# Altium schematic sheet Snip_MCU.SchDoc
size C
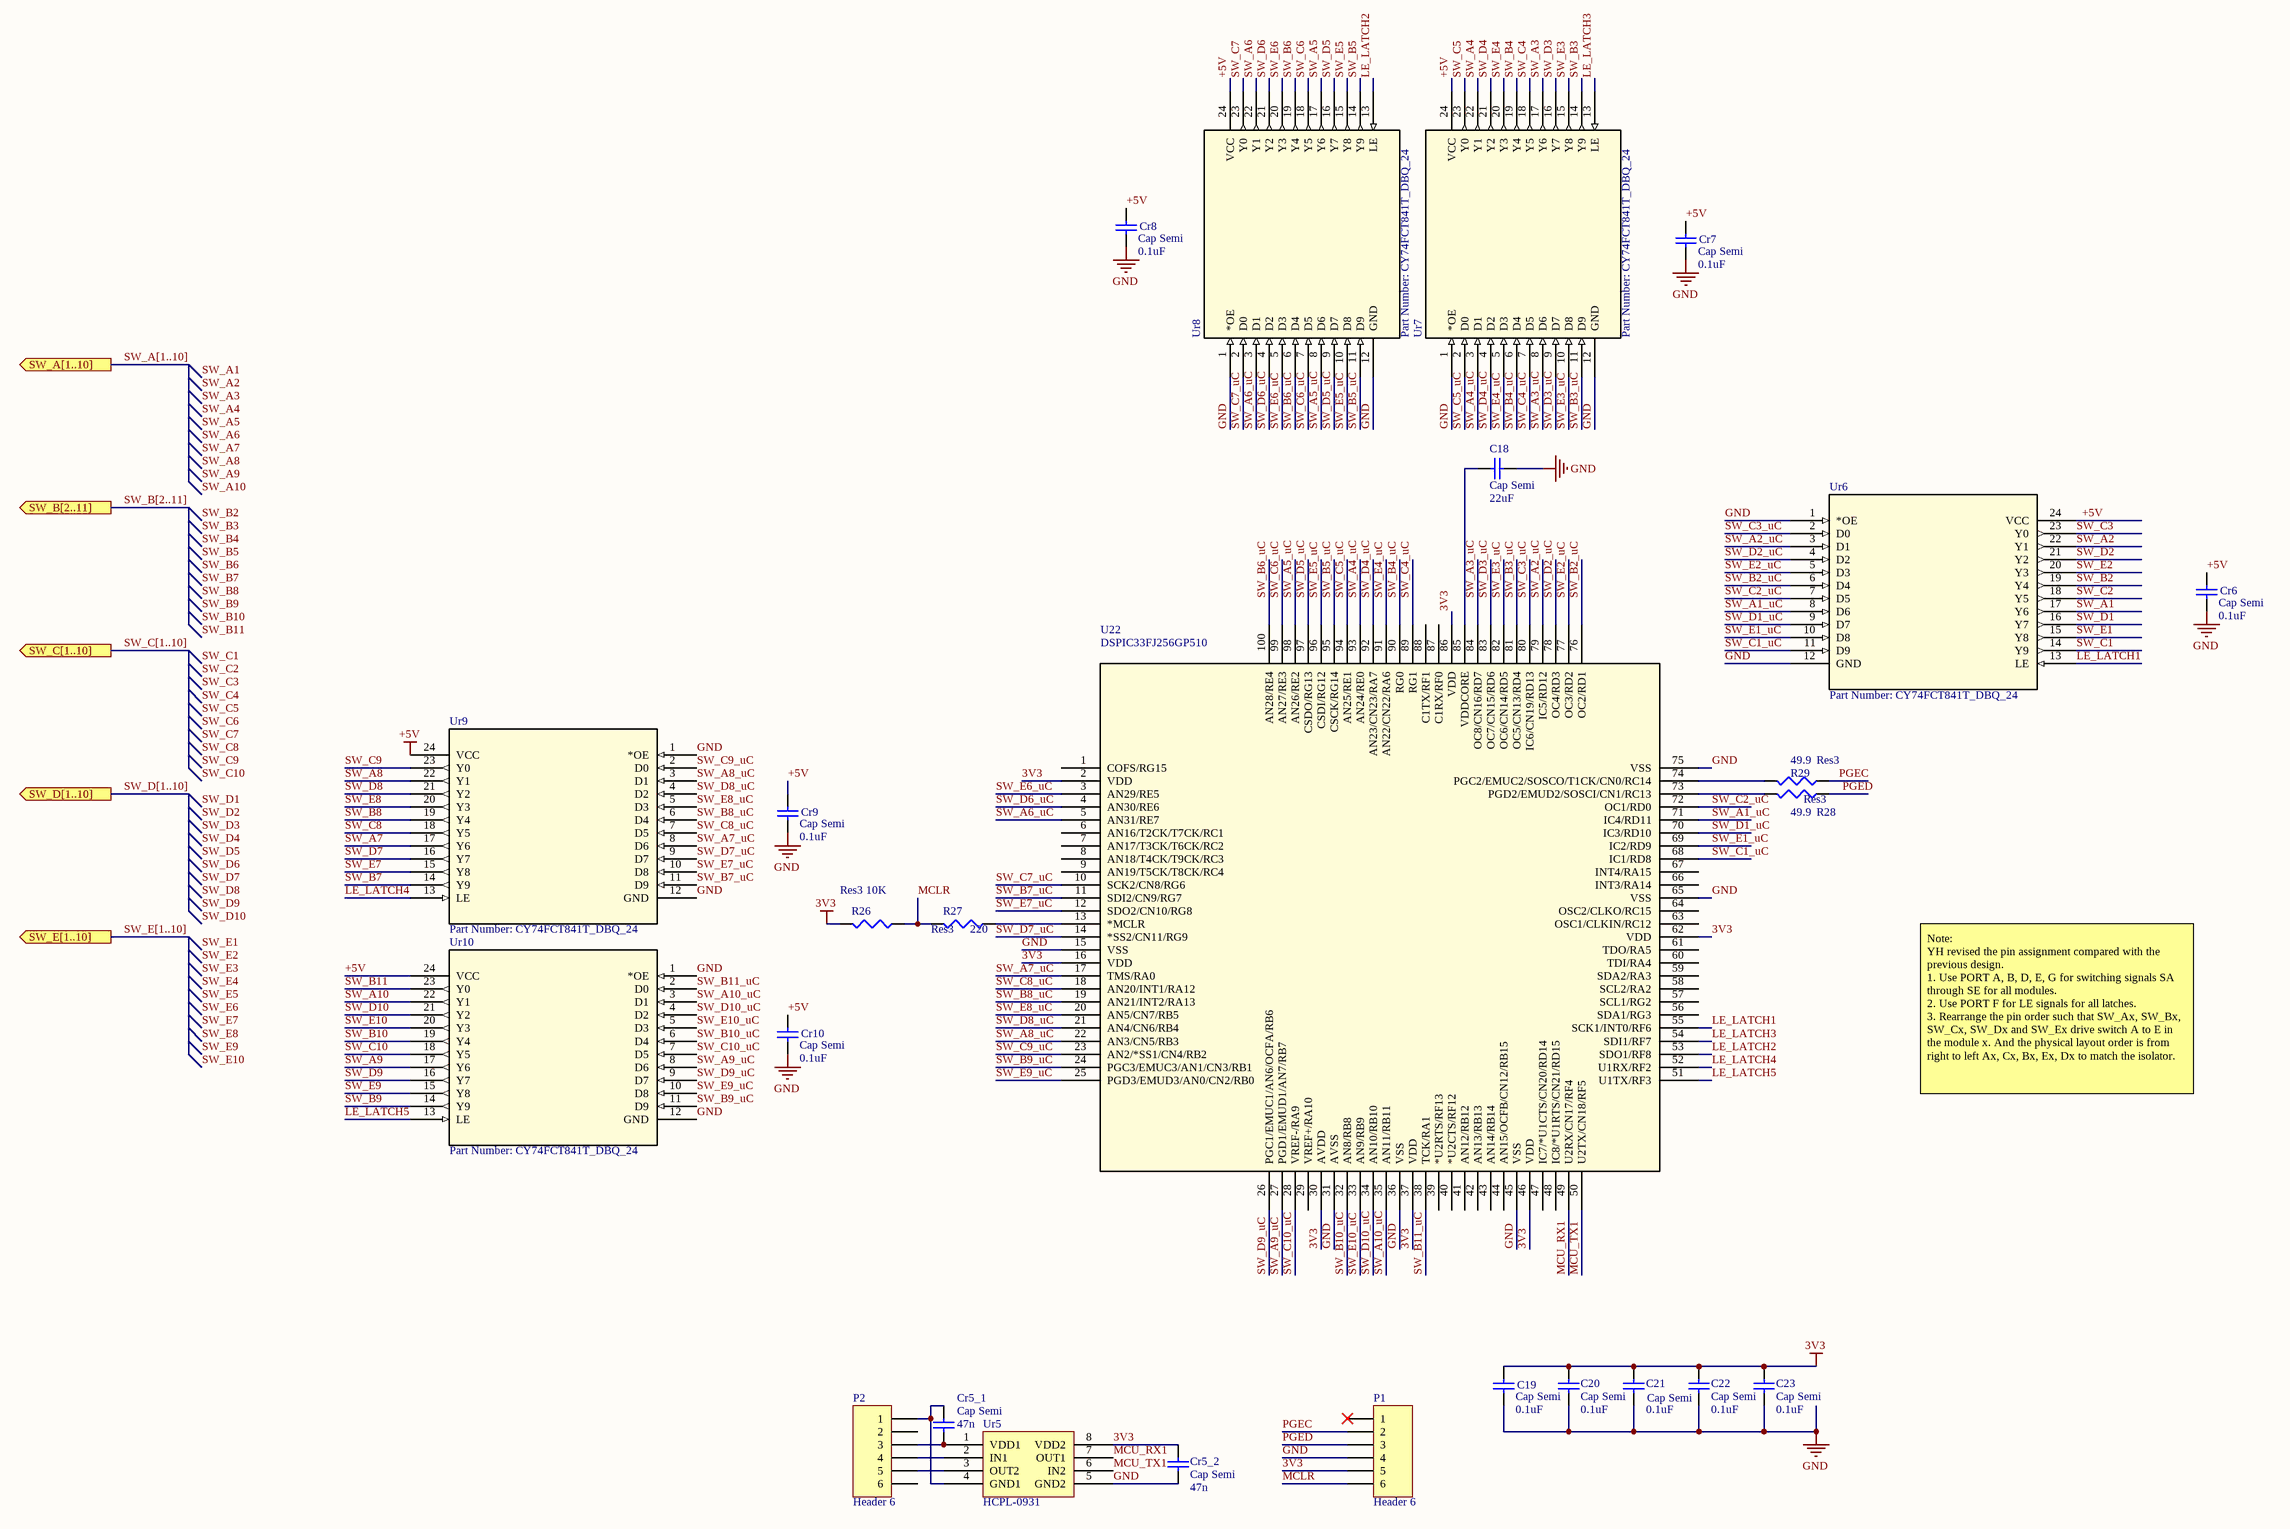
[diagram p0: Snip_MCU.SchDoc]

## Parts
C18  Cap Semi  value 22uF  [0805]
C19  Cap Semi  value 0.1uF  [1608[0603]]
C20  Cap Semi  value 0.1uF  [1608[0603]]
C21  Cap Semi  value 0.1uF  [1608[0603]]
C22  Cap Semi  value 0.1uF  [1608[0603]]
C23  Cap Semi  value 0.1uF  [1608[0603]]
Cr5_1  Cap Semi  value 47n  [C1206]
Cr5_2  Cap Semi  value 47n  [C1206]
Cr6  Cap Semi  value 0.1uF  [1608[0603]]
Cr7  Cap Semi  value 0.1uF  [1608[0603]]
Cr8  Cap Semi  value 0.1uF  [1608[0603]]
Cr9  Cap Semi  value 0.1uF  [1608[0603]]
Cr10  Cap Semi  value 0.1uF  [1608[0603]]
P1  Header 6  [HDR1X6]
P2  Header 6  [HDR1X6]
R26  Res3  value 10K  [J1-0603]
R27  Res3  value 220  [J1-0603]
R28  Res3  value 49.9  [J1-0603]
R29  Res3  value 49.9  [J1-0603]
U22  DSPIC33FJ256GP510  [TQFP100_12x12MC-]
Ur5  HCPL-0931  [SOIC-8]
Ur6  Part Number: CY74FCT841T_DBQ_24  [DBQ24]
Ur7  Part Number: CY74FCT841T_DBQ_24  [DBQ24]
Ur8  Part Number: CY74FCT841T_DBQ_24  [DBQ24]
Ur9  Part Number: CY74FCT841T_DBQ_24  [DBQ24]
Ur10  Part Number: CY74FCT841T_DBQ_24  [DBQ24]

## Ports
SW_A[1..10] (out), SW_B[2..11] (out), SW_C[1..10] (out), SW_D[1..10] (out), SW_E[1..10] (out)

## Nets
3V3: C19.2 C20.2 C21.2 C22.2 C23.2 Cr5_2.2 P1.5 R26.2 U22.2(VDD) U22.16(VDD) U22.30(AVDD) U22.37(VDD) U22.46(VDD) U22.62(VDD) U22.86(VDD) Ur5.8(VDD2)
+5V: Cr6.2 Cr7.2 Cr8.2 Cr9.2 Cr10.2 Ur6.24(VCC) Ur7.24(VCC) Ur8.24(VCC) Ur9.24(VCC) Ur10.24(VCC)
GND: C18.2 C19.1 C20.1 C21.1 C22.1 C23.1 Cr5_2.1 Cr6.1 Cr7.1 Cr8.1 Cr9.1 Cr10.1 P1.4 U22.15(VSS) U22.31(AVSS) U22.36(VSS) U22.45(VSS) U22.65(VSS) U22.75(VSS) Ur5.5(GND2) Ur6.1(*OE) Ur6.12(GND) Ur7.1(*OE) Ur7.12(GND) Ur8.1(*OE) Ur8.12(GND) Ur9.1(*OE) Ur9.12(GND) Ur10.1(*OE) Ur10.12(GND)
LE_LATCH1: U22.55(SCK1/INT0/RF6) Ur6.13(LE)
LE_LATCH2: U22.53(SDO1/RF8) Ur8.13(LE)
LE_LATCH3: U22.54(SDI1/RF7) Ur7.13(LE)
LE_LATCH4: U22.52(U1RX/RF2) Ur9.13(LE)
LE_LATCH5: U22.51(U1TX/RF3) Ur10.13(LE)
MCLR: P1.6 R26.1 R27.2
MCU_RX1: U22.49(U2RX/CN17/RF4) Ur5.7(OUT1)
MCU_TX1: U22.50(U2TX/CN18/RF5) Ur5.6(IN2)
PGEC: P1.2 R29.1
PGED: P1.3 R28.1
SW_A1: Ur6.17(Y6)
SW_A1_uC: U22.71(IC4/RD11) Ur6.8(D6)
SW_A2: Ur6.22(Y1)
SW_A2_uC: U22.79(IC5/RD12) Ur6.3(D1)
SW_A3: Ur7.17(Y6)
SW_A3_uC: U22.84(OC8/CN16/RD7) Ur7.8(D6)
SW_A4: Ur7.22(Y1)
SW_A4_uC: U22.93(AN24/RE0) Ur7.3(D1)
SW_A5: Ur8.17(Y6)
SW_A5_uC: U22.98(AN26/RE2) Ur8.8(D6)
SW_A6: Ur8.22(Y1)
SW_A6_uC: U22.5(AN31/RE7) Ur8.3(D1)
SW_A7: Ur9.17(Y6)
SW_A7_uC: U22.17(TMS/RA0) Ur9.8(D6)
SW_A8: Ur9.22(Y1)
SW_A8_uC: U22.22(AN3/CN5/RB3) Ur9.3(D1)
SW_A9: Ur10.17(Y6)
SW_A9_uC: U22.27(PGD1/EMUD1/AN7/RB7) Ur10.8(D6)
SW_A10: Ur10.22(Y1)
SW_A10_uC: U22.35(AN11/RB11) Ur10.3(D1)
SW_B2: Ur6.19(Y4)
SW_B2_uC: U22.76(OC2/RD1) Ur6.6(D4)
SW_B3: Ur7.14(Y9)
SW_B3_uC: U22.81(OC5/CN13/RD4) Ur7.11(D9)
SW_B4: Ur7.19(Y4)
SW_B4_uC: U22.90(RG0) Ur7.6(D4)
SW_B5: Ur8.14(Y9)
SW_B5_uC: U22.95(CSCK/RG14) Ur8.11(D9)
SW_B6: Ur8.19(Y4)
SW_B6_uC: U22.100(AN28/RE4) Ur8.6(D4)
SW_B7: Ur9.14(Y9)
SW_B7_uC: U22.11(SDI2/CN9/RG7) Ur9.11(D9)
SW_B8: Ur9.19(Y4)
SW_B8_uC: U22.19(AN21/INT2/RA13) Ur9.6(D4)
SW_B9: Ur10.14(Y9)
SW_B9_uC: U22.24(PGC3/EMUC3/AN1/CN3/RB1) Ur10.11(D9)
SW_B10: Ur10.19(Y4)
SW_B10_uC: U22.32(AN8/RB8) Ur10.6(D4)
SW_B11: Ur10.23(Y0)
SW_B11_uC: U22.38(TCK/RA1) Ur10.2(D0)
SW_C1: Ur6.14(Y9)
SW_C1_uC: U22.68(IC1/RD8) Ur6.11(D9)
SW_C2: Ur6.18(Y5)
SW_C2_uC: U22.72(OC1/RD0) Ur6.7(D5)
SW_C3: Ur6.23(Y0)
SW_C3_uC: U22.80(IC6/CN19/RD13) Ur6.2(D0)
SW_C4: Ur7.18(Y5)
SW_C4_uC: U22.89(RG1) Ur7.7(D5)
SW_C5: Ur7.23(Y0)
SW_C5_uC: U22.94(AN25/RE1) Ur7.2(D0)
SW_C6: Ur8.18(Y5)
SW_C6_uC: U22.99(AN27/RE3) Ur8.7(D5)
SW_C7: Ur8.23(Y0)
SW_C7_uC: U22.10(SCK2/CN8/RG6) Ur8.2(D0)
SW_C8: Ur9.18(Y5)
SW_C8_uC: U22.18(AN20/INT1/RA12) Ur9.7(D5)
SW_C9: Ur9.23(Y0)
SW_C9_uC: U22.23(AN2/*SS1/CN4/RB2) Ur9.2(D0)
SW_C10: Ur10.18(Y5)
SW_C10_uC: U22.28(VREF-/RA9) Ur10.7(D5)
SW_D1: Ur6.16(Y7)
SW_D1_uC: U22.70(IC3/RD10) Ur6.9(D7)
SW_D2: Ur6.21(Y2)
SW_D2_uC: U22.78(OC4/RD3) Ur6.4(D2)
SW_D3: Ur7.16(Y7)
SW_D3_uC: U22.83(OC7/CN15/RD6) Ur7.9(D7)
SW_D4: Ur7.21(Y2)
SW_D4_uC: U22.92(AN23/CN23/RA7) Ur7.4(D2)
SW_D5: Ur8.16(Y7)
SW_D5_uC: U22.97(CSDO/RG13) Ur8.9(D7)
SW_D6: Ur8.21(Y2)
SW_D6_uC: U22.4(AN30/RE6) Ur8.4(D2)
SW_D7: Ur9.16(Y7)
SW_D7_uC: U22.14(*SS2/CN11/RG9) Ur9.9(D7)
SW_D8: Ur9.21(Y2)
SW_D8_uC: U22.21(AN4/CN6/RB4) Ur9.4(D2)
SW_D9: Ur10.16(Y7)
SW_D9_uC: U22.26(PGC1/EMUC1/AN6/OCFA/RB6) Ur10.9(D7)
SW_D10: Ur10.21(Y2)
SW_D10_uC: U22.34(AN10/RB10) Ur10.4(D2)
SW_E1: Ur6.15(Y8)
SW_E1_uC: U22.69(IC2/RD9) Ur6.10(D8)
SW_E2: Ur6.20(Y3)
SW_E2_uC: U22.77(OC3/RD2) Ur6.5(D3)
SW_E3: Ur7.15(Y8)
SW_E3_uC: U22.82(OC6/CN14/RD5) Ur7.10(D8)
SW_E4: Ur7.20(Y3)
SW_E4_uC: U22.91(AN22/CN22/RA6) Ur7.5(D3)
SW_E5: Ur8.15(Y8)
SW_E5_uC: U22.96(CSDI/RG12) Ur8.10(D8)
SW_E6: Ur8.20(Y3)
SW_E6_uC: U22.3(AN29/RE5) Ur8.5(D3)
SW_E7: Ur9.15(Y8)
SW_E7_uC: U22.12(SDO2/CN10/RG8) Ur9.10(D8)
SW_E8: Ur9.20(Y3)
SW_E8_uC: U22.20(AN5/CN7/RB5) Ur9.5(D3)
SW_E9: Ur10.15(Y8)
SW_E9_uC: U22.25(PGD3/EMUD3/AN0/CN2/RB0) Ur10.10(D8)
SW_E10: Ur10.20(Y3)
SW_E10_uC: U22.33(AN9/RB9) Ur10.5(D3)
NetC18_1: C18.1 U22.85(VDDCORE)
NetCr5_1_1: Cr5_1.1 P2.3 Ur5.1(VDD1)
NetCr5_1_2: Cr5_1.2 P2.1 Ur5.4(GND1)
NetP2_4: P2.4 Ur5.2(IN1)
NetP2_5: P2.5 Ur5.3(OUT2)
NetR27_1: R27.1 U22.13(*MCLR)
NetR28_2: R28.2 U22.73(PGD2/EMUD2/SOSCI/CN1/RC13)
NetR29_2: R29.2 U22.74(PGC2/EMUC2/SOSCO/T1CK/CN0/RC14)

Not connected (* = marked no-connect by the designer): P1 1*; P2 2 6; U22 1(COFS/RG15) 6(AN16/T2CK/T7CK/RC1) 7(AN17/T3CK/T6CK/RC2) 8(AN18/T4CK/T9CK/RC3) 9(AN19/T5CK/T8CK/RC4) 29(VREF+/RA10) 39(*U2RTS/RF13) 40(*U2CTS/RF12) 41(AN12/RB12) 42(AN13/RB13) 43(AN14/RB14) 44(AN15/OCFB/CN12/RB15) 47(IC7/*U1CTS/CN20/RD14) 48(IC8/*U1RTS/CN21/RD15) 56(SDA1/RG3) 57(SCL1/RG2) 58(SCL2/RA2) 59(SDA2/RA3) 60(TDI/RA4) 61(TDO/RA5) 63(OSC1/CLKIN/RC12) 64(OSC2/CLKO/RC15) 66(INT3/RA14) 67(INT4/RA15) 87(C1RX/RF0) 88(C1TX/RF1)

## Buses and harness runs
bus SW_A[1..10] = port SW_A[1..10]
bus SW_B[2..11] = port SW_B[2..11]
bus SW_C[1..10] = port SW_C[1..10]
bus SW_D[1..10] = port SW_D[1..10]
bus SW_E[1..10] = port SW_E[1..10]

## Notes on the sheet
- Note:
  YH revised the pin assignment compared with the previous design.
  1. Use PORT A, B, D, E, G for switching signals SA through SE for all modules.
  2. Use PORT F for LE signals for all latches.
  3. Rearrange the pin order such that SW_Ax, SW_Bx, SW_Cx, SW_Dx and SW_Ex drive switch A to E in the module x. And the physical layout order is from right to left Ax, Cx, Bx, Ex, Dx to match the isolator.
- Labels drawn without touching a wire or pin: SW_A1, SW_A2, SW_A3, SW_A4, SW_A5, SW_A6, SW_A7, SW_A8, SW_A9, SW_A10, SW_B2, SW_B3, SW_B4, SW_B5, SW_B6, SW_B7, SW_B8, SW_B9, SW_B10, SW_B11, SW_C1, SW_C2, SW_C3, SW_C4, SW_C5, SW_C6, SW_C7, SW_C8, SW_C9, SW_C10, SW_D1, SW_D2, SW_D3, SW_D4, SW_D5, SW_D6, SW_D7, SW_D8, SW_D9, SW_D10, SW_E1, SW_E2, SW_E3, SW_E4, SW_E5, SW_E6, SW_E7, SW_E8, SW_E9, SW_E10

## Library data of the parts
C18-C23 Cr5_1 Cr5_2 Cr6-Cr10 = Cap Semi: Capacitor (Semiconductor SIM Model); Published: 8-Jun-2000; LatestRevisionDate: 29-May-2009; LatestRevisionNote: IPC-7351 Footprint Added.; PackageReference: C1206; Publisher: Altium Limited; PackageDescription: Chip Capacitor
P1 P2 = Header 6: Header, 6-Pin; LatestRevisionDate: 17-Jul-2002; LatestRevisionNote: Re-released for DXP Platform.; Publisher: Altium Limited
R26-R29 = Res3: Resistor; Published: 8-Jun-2000; LatestRevisionDate: 29-May-2009; LatestRevisionNote: IPC-7351 Footprint Added.; PackageReference: J1-0603; Publisher: Altium Limited; PackageDescription: Chip Resistor
U22 = DSPIC33FJ256GP510: No Description Available; Copyright: Copyright (C) 2018 Accelerated Designs. All rights reserved; RefDes: RefDes; Type: DEV; Value: Value
Ur6-Ur10 = CY74FCT841T_DBQ_: 10-Bit Bus-Interface D-Type Latches with 3-State Outputs; Manufacturer: Texas Instruments; INDUSTRY_STD_PKG_TYPE: SSOP/QSOP; PIN_COUNT: 24; PACKAGE_DESIGNATOR: DBQ; Datasheet_URL: http://www.ti.com/lit/gpn/CY74FCT841T; FAMILY_NAME: D-TYPE LATCH; GENERIC_PART_NUMBER: CY74FCT841T; Vendor: Texas Instruments; Manufacturer_Part_Number: CY74FCT841T_DBQ_24; Copyright: Copyright (C) 2018 Accelerated Designs. All rights reserved; RefDes: RefDes; Type: DEV; Value: Value
Ur5 = HCPL-0931: ComponentLink: http://www.digikey.com/product-detail/en/broadcom-limited/HCPL-0931/516-2702-5-ND/969355